# Altium schematic sheet supply.SCHDOC
size A4
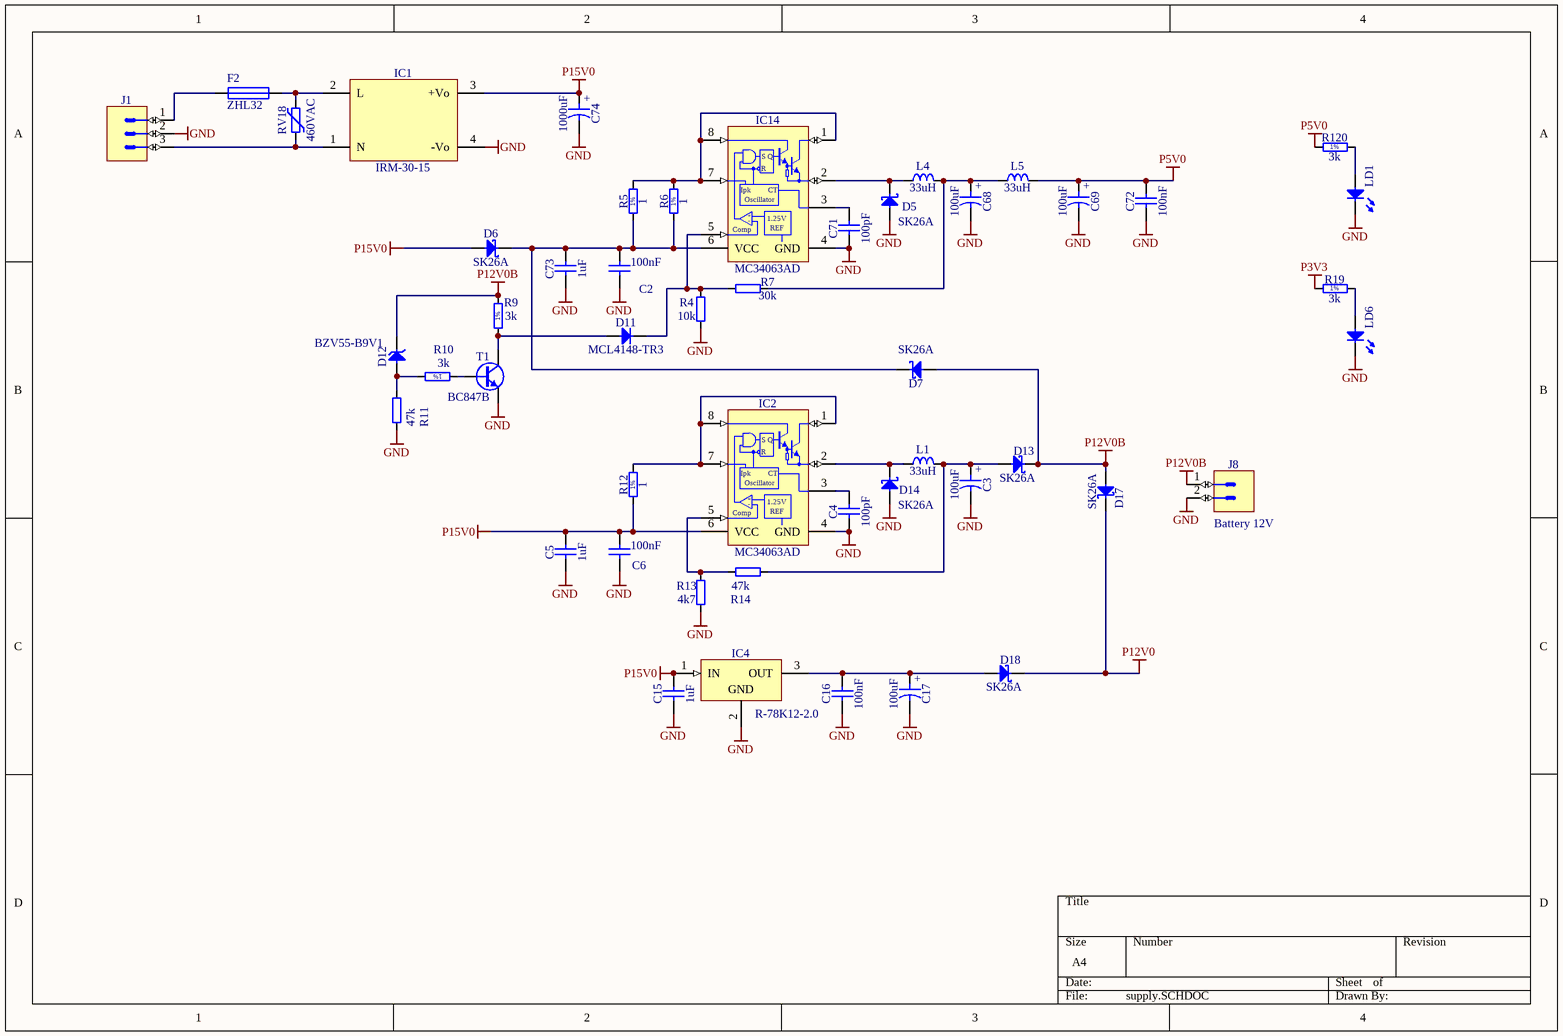
[diagram p0: supply.SCHDOC]

## Parts
C2  100nF  [CAPC1608X87N]
C3  100uF  [CAPAE660X540N]
C4  100pF  [CAPC1608X87N]
C5  1uF  [CAPC1608X87N]
C6  100nF  [CAPC1608X87N]
C15  1uF  [CAPC1608X87N]
C16  100nF  [CAPC1608X87N]
C17  100uF  [CAPAE660X540N]
C68  100uF  [CAPAE660X540N]
C69  100uF  [CAPAE660X540N]
C71  100pF  [CAPC1608X87N]
C72  100nF  [CAPC1608X87N]
C73  1uF  [CAPC1608X87N]
C74  1000uF  [CAPPR500-1050X2200]
D5  SK26A  [DIOM5126X265N]
D6  SK26A  [DIOM5126X265N]
D7  SK26A  [DIOM5126X265N]
D11  MCL4148-TR3  [DIOMELF1911N]
D12  BZV55-B9V1  [DIOMELF3515N]
D13  SK26A  [DIOM5126X265N]
D14  SK26A  [DIOM5126X265N]
D17  SK26A  [DIOM5126X265N]
D18  SK26A  [DIOM5126X265N]
F2  ZHL32  [fuse_ZHL32]
IC1  IRM-30-15  [PWS_MEANWELL_IRM-30]
IC2  MC34063AD  [SOIC127P600X175-8N]
IC4  R-78K12-2.0  [DCDC_RECOM_R-78C]
IC14  MC34063AD  [SOIC127P600X175-8N]
J1  (no value)  [PHOENIX_1757255]
J8  (no value)  [PHOENIX_1803277]
L1  33uH  [IND_BOURNS_SRP1038A]
L4  33uH  [IND_BOURNS_SRP1038A]
L5  33uH  [IND_BOURNS_SRP1038A]
LD1  Green  [LED_KINGBRIGHT_KP-1608CGCK]  (value not drawn)
LD6  Green  [LED_KINGBRIGHT_KP-1608CGCK]  (value not drawn)
R4  10k  [RESC1608X55N]
R5  1  [RESC1608X55N]
R6  1  [RESC1608X55N]
R7  30k  [RESC1608X55N]
R9  3k  [RESC1608X55N]
R10  3k  [RESC1608X55N]
R11  47k  [RESC1608X55N]
R12  1  [RESC1608X55N]
R13  4k7  [RESC1608X55N]
R14  47k  [RESC1608X55N]
R19  3k  [RESC1608X55N]
R120  3k  [RESC1608X55N]
RV18  460VAC  [VAR_EPCOS_B72210S0461K101]
T1  BC847B  [SOT95P230X110-3N]

## Nets
GND: C2.1 C3.2 C4.1 C5.1 C6.1 C15.1 C16.1 C17.2 C68.2 C69.2 C71.1 C72.1 C73.1 C74.2 D5.2(A) D14.2(A) IC1.4(-Vo) IC2.4(GND) IC4.2(GND) IC14.4(GND) J1.2 J8.2 LD1.1(C) LD6.1(C) R4.1 R11.1 R13.1 T1.2(E)
P3V3: R19.1
P5V0: C69.1 C72.2 L5.2 R120.1
P12V0: D17.1(C) D18.1(C)
P12V0B: D7.2(A) D12.1(C) D13.1(C) D17.2(A) J8.1 R9.2
P15V0: C5.2 C6.2 C15.2 C74.1 D6.2(A) IC1.3(+Vo) IC2.6(VCC) IC4.1(IN) R12.1
NetC2_2: C2.2 C73.2 D6.1(C) D7.1(C) IC14.6(VCC) R5.1 R6.1
NetC3_1: C3.1 D13.2(A) L1.2 R14.2
NetC4_2: C4.2 IC2.3(TC)
NetC16_2: C16.2 C17.1 D18.2(A) IC4.3(OUT)
NetC68_1: C68.1 L4.2 L5.1 R7.2
NetC71_2: C71.2 IC14.3(TC)
NetD5_1: D5.1(C) IC14.2(SWE) L4.1
NetD11_1: D11.1(C) IC14.5(COMP) R4.2 R7.1
NetD11_2: D11.2(A) R9.1 T1.3(C)
NetD12_2: D12.2(A) R10.2 R11.2
NetD14_1: D14.1(C) IC2.2(SWE) L1.1
NetF2_1: F2.1 J1.1
NetF2_2: F2.2 IC1.2(L) RV18.2
NetIC1_1: IC1.1(N) J1.3 RV18.1
NetIC2_1: IC2.1(SWC) IC2.7(Ipk) IC2.8(DRVC) R12.2
NetIC2_5: IC2.5(COMP) R13.2 R14.1
NetIC14_1: IC14.1(SWC) IC14.7(Ipk) IC14.8(DRVC) R5.2 R6.2
NetLD1_2: LD1.2(A) R120.2
NetLD6_2: LD6.2(A) R19.2
NetR10_1: R10.1 T1.1(B)

## Notes on the sheet
- (near J8) Battery 12V
- (in symbol CAE660-540_100UF_16V_20%) +
- (in symbol CAER_1000UF_25V_20%_VISHAY_MAL203856102E3) +
- (in symbol MC34063AD) S; Q; R; CT; Oscillator; +; -; 1.25V; Comp; REF
- (in symbol R0603_1R_1%_0.1W_200PPM) 1%
- (in symbol R0603_3K_1%_0.1W_100PPM) 1%

## Library data of the parts
C2 C6 C16 C72 = CC0603_100NF_50V_10%_X7R: Non-polarised capacitor; Part Description: SMD Multilayer Chip Ceramic Capacitor; Manufacturer: GENERIC; Manufacturer1 Part Number: 223858615649; Voltage: 50V; TC: X7R; Tolerance: ±10%; Part Number: CC0603_100NF_50V_10%_X7R; Component Kind: Standard; Component Type: Standard; Pin Count: 2; Value: 100nF; Status: Preferred; Manufacturer Part Number: CC0603_100NF_50V_10%_X7R; Case: 0603; Mounted: Yes; Socket: No; SMD: Yes; Sense: No; Manufacturer1 Example: PHYCOMP; Manufacturer1 ComponentHeight: 0.87mm; HelpURL: \\cern.ch\dfs\Applications\Altium\Datasheets\CC0603_X7R_PHYCOMP.pdf; Author: CERN DEM JLC; CreateDate: 2007-12-03; LatestRevisionDate: 2007-12-03
C3 C17 C68 C69 = CAE660-540_100UF_16V_20%: Polarised capacitor; Part Description: Aluminum Electrolytic SMT Capacitor; Manufacturer: PANASONIC; Manufacturer Part Number: EEEFK1C101AP; Voltage: 16V; Tolerance: ±20%; Part Number: CAE660-540_100UF_16V_20%; Component Kind: Standard; Component Type: Standard; Pin Count: 2; Value: 100uF; Status: Not Recommended; Case: D; Mounted: Yes; Socket: No; SMD: Yes; Sense: No; ComponentHeight: 5.8mm; HelpURL: \\cern.ch\dfs\Applications\Altium\Datasheets\CAE_PANASONIC_FK.pdf; Author: CERN DEM JLC; CreateDate: 2007-12-03; LatestRevisionDate: 2014-11-05
C4 C71 = CC0603_100PF_50V_10%_X7R: Non-polarised capacitor; Part Description: SMD Multilayer Chip Ceramic Capacitor; Manufacturer: GENERIC; Manufacturer1 Part Number: 223858615609; Voltage: 50V; TC: X7R; Tolerance: ±10%; Part Number: CC0603_100PF_50V_10%_X7R; Component Kind: Standard; Component Type: Standard; Pin Count: 2; Value: 100pF; Status: Preferred; Manufacturer Part Number: CC0603_100PF_50V_10%_X7R; Case: 0603; Mounted: Yes; Socket: No; SMD: Yes; Sense: No; Manufacturer1 Example: PHYCOMP; Manufacturer1 ComponentHeight: 0.9mm; HelpURL: \\cern.ch\dfs\Applications\Altium\Datasheets\CC0603_X7R_PHYCOMP.pdf; Author: CERN DEM JLC; CreateDate: 2012-08-15; LatestRevisionDate: 2012-08-15
C5 C15 C73 = CC0603_1UF_25V_10%_X7R: Non-polarised capacitor; Part Description: SMD Multilayer Chip Ceramic Capacitor; Manufacturer: GENERIC; Manufacturer1 Part Number: GRM188R71E105KA12D; Voltage: 25V; TC: X7R; Tolerance: ±10%; Part Number: CC0603_1UF_25V_10%_X7R; Component Kind: Standard; Component Type: Standard; Pin Count: 2; Value: 1uF; Status: None; Manufacturer Part Number: CC0603_1UF_25V_10%_X7R; Case: 0603; Mounted: Yes; Socket: No; SMD: Yes; Sense: No; Manufacturer1 Example: MURATA; Manufacturer1 ComponentHeight: 0.9mm; HelpURL: \\cern.ch\dfs\Applications\Altium\Datasheets\CC0603_X7R_MURATA.pdf; Author: CERN DEM JLC; CreateDate: 2011-01-18; LatestRevisionDate: 2011-01-18
C74 = CAER_1000UF_25V_20%_VISHAY_MAL203856102E3: Polarised capacitor; Part Description: Radial Standard Ultra Miniature Aluminum Electrolytic Capacitor (038 RSU Series); Manufacturer: VISHAY BCCOMPONENTS; Voltage: 25V; Tolerance: ±20%; Part Number: CAER_1000UF_25V_20%_VISHAY_MAL203856102E3; Component Kind: Standard; Component Type: Standard; Pin Count: 2; Value: 1000uF; Status: None; Manufacturer Part Number: MAL203856102E3; Case: LS5 D10.5 x H22; Mounted: Yes; Socket: No; SMD: No; Sense: No; ComponentHeight: 22mm; HelpURL: \\cern.ch\dfs\Applications\Altium\Datasheets\CAER_VISHAY_038 RSU.pdf; Author: CERN DEM JLC; CreateDate: 2012-08-27; LatestRevisionDate: 2012-08-27
D5-D7 D13 D14 D17 D18 = SK26A: Schottky Diode; Part Description: 2A, 60V Surface Mount Schottky Barrier Rectifier; Manufacturer: TAIWAN SEMICONDUCTOR; Voltage: 60V; Power: 2A; PressFit: No; Bonding: No; Part Number: SK26A; Component Kind: Standard; Component Type: Standard; Device: SK26A; PackageDescription: DO-214-AC/SMA Molded Diode, 2-Leads, Body 5.1x2.6mm, IPC Medium Density; Manufacturer Part Number: SK26A; Pin Count: 2; Case: DO-214AC; Mounted: Yes; Socket: No; SMD: Yes; Sense: No; ComponentHeight: 2.5mm; HelpURL: \\cern.ch\dfs\Applications\Altium\Datasheets\SK26A.pdf; Author: CERN DEM JMW; CreateDate: 2015-08-07; LatestRevisionDate: 2015-08-07
D11 = MCL4148-TR3: Diode; Part Description: Small Signal Fast Switching Diode; Manufacturer: VISHAY GENERAL SEMICONDUCTOR; Voltage: 75V; Power: 200mA; PressFit: No; Bonding: No; Part Number: MCL4148-TR3; Component Kind: Standard; Component Type: Standard; Device: MCL4148-TR3; PackageDescription: MELF Diode, 2-Leads, Body 1.7x1.15mm, IPC Medium Density; Manufacturer Part Number: MCL4148; Pin Count: 2; Mounted: Yes; Socket: No; SMD: Yes; Sense: No; ComponentHeight: 1.35mm; HelpURL: \\cern.ch\dfs\Applications\Altium\Datasheets\MCL4148-TR3.pdf; Author: CERN DEM JLC; CreateDate: 10.11.2014; LatestRevisionDate: 10.11.2014
D12 = BZV55-B9V1: Zener Diode; Part Description: Voltage Regulator Diode; Manufacturer: NEXPERIA; Voltage: 9V1; Power: 500mW; PressFit: No; Bonding: No; Part Number: BZV55-B9V1; Component Kind: Standard; Component Type: Standard; Device: BZV55-B9V1; PackageDescription: SOD80C, MELF Diode, 2-Leads, Body 3.5x1.5mm, IPC Medium Density; Manufacturer Part Number: BZV55-B9V1; Pin Count: 2; Case: SOD-80C; Mounted: Yes; Socket: No; SMD: Yes; Sense: No; ComponentHeight: 1.6mm; HelpURL: \\cern.ch\dfs\Applications\Altium\Datasheets\BZV55.pdf; Author: CERN DEM JLC; CreateDate: 06.05.2008; LatestRevisionDate: 22.01.2018
F2 = FUSE
IC1 = AC_DC_IRM-30-15: Power Supply; Part Description: 85-264VAC to 15VDC (2000mA) 30W Power Supply; Manufacturer: MEAN WELL; PressFit: No; Bonding: No; Part Number: IRM-30-15; Component Kind: Standard; Component Type: Standard; Device: IRM-30-15; PackageDescription: IRM-10 Series, Body 45.7x25.4mm, Power Supply; Status: None; Manufacturer Part Number: IRM-30-15; Pin Count: 4; Mounted: Yes; Socket: No; SMD: No; Sense: No; ComponentHeight: 21.5mm; HelpURL: \\cern.ch\dfs\Applications\Altium\Datasheets\IRM-10-12.pdf; Author: GK; CreateDate: 14.02.2018; LatestRevisionDate: 14.02.2018
IC2 IC14 = MC34063AD: 3V to 40V 1.5A Peak Boost/Buck/Inverting Switching Regulator; Manufacturer: TEXAS INSTRUMENTS; PressFit: No; Bonding: No; Part Number: MC34063AD; Component Kind: Standard; Component Type: Standard; Device: MC34063AD; PackageDescription: SOIC 8, Pitch 1.27mm - Body 4x5mm, IPC Medium Density; Part Description: 3V to 40V 1.5A Peak Boost/Buck/Inverting Switching Regulator; Manufacturer Part Number: MC34063AD; Pin Count: 8; Case: SOIC8; Mounted: Yes; Socket: No; SMD: Yes; Sense: No; ComponentHeight: 1.75mm; HelpURL: \\cern.ch\dfs\Applications\Altium\Datasheets\MC34063AD.pdf; Author: CERN DEM JLC; CreateDate: 2009-10-27; LatestRevisionDate: 2009-10-27
IC4 = R-78C12-1.0: 15-42VDC to 12VDC, Iout (max) 1A, DC-DC Converter; Part Description: DC/DC; Uin: 14÷36V; Uout: 12VDC; Iout: 2A; SIP3; THT; Manufacturer: RECOM; PressFit: No; Bonding: No; Part Number: R-78K12-2.0; Component Kind: Standard; Component Type: Standard; Device: R-78K12-2.0; PackageDescription: R-78C Series, Body 11.6x8.50mm, SIP-3 Package; Manufacturer Part Number: R-78K12-2.0; Pin Count: 3; Mounted: Yes; Socket: No; SMD: No; Sense: No; ComponentHeight: 10.9mm; HelpURL: \\cern.ch\dfs\Applications\Altium\Datasheets\RECOM_R-78C.pdf; Author: CERN DEM BC; CreateDate: 19.08.2020; LatestRevisionDate: 19.08.2020
J1 = PHOENIX_1757255: Connector 3 Male; Part Description: 12A, 250V, Pitch 5.08mm, 3 Positions Header; Manufacturer: PHOENIX CONTACT; Manufacturer Part Number: 1757255 (MSTBA 2,5/ 3-G-5,08); PressFit: No; Part Number: PHOENIX_1757255; Component Kind: Standard; Component Type: Standard; Pin Count: 3; Mounted: Yes; Socket: No; SMD: No; Sense: No; Status: None; ComponentHeight: 8.6mm; HelpURL: \\cern.ch\dfs\Applications\Altium\Datasheets\PHOENIX_1757255.pdf; Author: CERN DEM JLC; CreateDate: 10.02.2010; LatestRevisionDate: 26.04.2010
J8 = PHOENIX_1803277: Connector 2 Male; Part Description: 8A 160 V, Pitch: 3.81mm, 2 Positions  Right Angled Header; Manufacturer: PHOENIX CONTACT; Manufacturer Part Number: 1803277 (MC 1,5/ 2-G-3,81); PressFit: No; Part Number: PHOENIX_1803277; Component Kind: Standard; Component Type: Standard; Pin Count: 2; Mounted: Yes; Socket: No; SMD: No; Sense: No; Status: None; ComponentHeight: 7.25mm; HelpURL: \\cern.ch\dfs\Applications\Altium\Datasheets\PHOENIX_1803277.pdf; Author: CERN DEM JLC; CreateDate: 06.05.2014; LatestRevisionDate: 06.05.2014
L1 L4 L5 = IND_33UH_20%_BOURNS_SRP1038A: Inductor; Part Description: Shielded SMD Power Inductor; Manufacturer: BOURNS; Manufacturer Part Number: SRP1038A-330M; Power: 3.5A; Resistance: 0.092R; Tolerance: ±20%; Part Number: IND_33UH_20%_BOURNS_SRP1038A; Component Kind: Standard; Component Type: Standard; Pin Count: 2; Value: 33uH; Mounted: Yes; Socket: No; SMD: Yes; Sense: No; ComponentHeight: 4mm; HelpURL: \\cern.ch\dfs\Applications\Altium\Datasheets\IND_BOURNS_SRP1038A.pdf; Author: CERN DEM HF; CreateDate: 26.01.2024; LatestRevisionDate: 26.01.2024
LD1 LD6 = LED_KINGBRIGHT_KP-1608CGCK: LED Green 1C 2A; Part Description: 1.6x0.8mm SMD Chip Green LED Lamp; PressFit: No; Bonding: No; Part Number: LED_KINGBRIGHT_KP-1608CGCK; Component Kind: Standard; Component Type: Standard; Color: Green; PackageDescription: SMT Green LED, Case 0603, Body L 1.60mm x W 0.80mm x H 1.10mm; Manufacturer: KINGBRIGHT; Manufacturer Part Number: KP-1608CGCK; Pin Count: 2; Case: 0603; Mounted: Yes; Socket: No; SMD: Yes; Sense: No; ComponentHeight: 1.1mm; HelpURL: \\cern.ch\dfs\Applications\Altium\Datasheets\LED_KINGBRIGHT_KP-1608CGCK.pdf; Author: CERN DEM HF; CreateDate: 01.10.2021; LatestRevisionDate: 01.10.2021
R4 = R0603_10K_1%_0.1W_100PPM: Resistor - 1%; Part Description: General Purpose Thick Film Chip Resistor; Manufacturer: GENERIC; Manufacturer1 Part Number: NRC06F1002TRF; Power: 0.1W; TC: ±100ppm/°C; PressFit: No; Part Number: R0603_10K_1%_0.1W_100PPM; Component Kind: Standard; Component Type: Standard; Pin Count: 2; Value: 10k; Status: Preferred; Tolerance: ±1%; Manufacturer Part Number: R0603_10K_1%_0.1W_100PPM; Case: 0603; Mounted: Yes; Sense: No; Socket: No; SMD: Yes; Manufacturer1 Example: NIC COMPONENT; Manufacturer1 ComponentHeight: 0.55mm; HelpURL: \\cern.ch\dfs\Applications\Altium\Datasheets\R0603_NIC_NRC.pdf; Author: CERN DEM JLC; CreateDate: 03.12.2007; LatestRevisionDate: 13.03.2008
R5 R6 R12 = R0603_1R_1%_0.1W_200PPM: Resistor - 1%; Part Description: General Purpose Thick Film Chip Resistor; Manufacturer: GENERIC; Manufacturer1 Part Number: 232270461008L or RC0603FR-071RL; Power: 0.1W; TC: ±200ppm/°C; Part Number: R0603_1R_1%_0.1W_200PPM; Component Kind: Standard; Component Type: Standard; Pin Count: 2; Value: 1; Status: Preferred; Tolerance: ±1%; Manufacturer Part Number: R0603_1R_1%_0.1W_200PPM; Case: 0603; Mounted: Yes; Sense: No; Socket: No; SMD: Yes; Manufacturer1 Example: YAGEO PHYCOMP; Manufacturer1 ComponentHeight: 0.65mm; HelpURL: \\cern.ch\dfs\Applications\Altium\Datasheets\R0603_Phycomp_RC0603.pdf; Author: CERN DEM JLC; CreateDate: 2007-12-03; LatestRevisionDate: 2012-10-17
R7 = R0603_30K_1%_0.1W_100PPM: Resistor - 1%; Part Description: General Purpose Thick Film Chip Resistor; Manufacturer: GENERIC; Manufacturer1 Part Number: NRC06F3002TRF; Power: 0.1W; TC: ±100ppm/°C; PressFit: No; Part Number: R0603_30K_1%_0.1W_100PPM; Component Kind: Standard; Component Type: Standard; Pin Count: 2; Value: 30k; Status: Preferred; Tolerance: ±1%; Manufacturer Part Number: R0603_30K_1%_0.1W_100PPM; Case: 0603; Mounted: Yes; Sense: No; Socket: No; SMD: Yes; Manufacturer1 Example: NIC COMPONENT; Manufacturer1 ComponentHeight: 0.55mm; HelpURL: \\cern.ch\dfs\Applications\Altium\Datasheets\R0603_NIC_NRC.pdf; Author: CERN DEM JLC; CreateDate: 03.12.2007; LatestRevisionDate: 13.03.2008
R9 R10 R19 R120 = R0603_3K_1%_0.1W_100PPM: Resistor - 1%; Part Description: General Purpose Thick Film Chip Resistor; Manufacturer: GENERIC; Manufacturer1 Part Number: NRC06F3001TRF; Power: 0.1W; TC: ±100ppm/°C; Part Number: R0603_3K_1%_0.1W_100PPM; Component Kind: Standard; Component Type: Standard; Pin Count: 2; Value: 3k; Status: Preferred; Tolerance: ±1%; Manufacturer Part Number: R0603_3K_1%_0.1W_100PPM; Case: 0603; Mounted: Yes; Sense: No; Socket: No; SMD: Yes; Manufacturer1 Example: NIC COMPONENT; Manufacturer1 ComponentHeight: 0.55mm; HelpURL: \\cern.ch\dfs\Applications\Altium\Datasheets\R0603_NIC_NRC.pdf; Author: CERN DEM JLC; CreateDate: 2007-12-03; LatestRevisionDate: 2008-03-13
R11 R14 = R0603_47K_1%_0.1W_100PPM: Resistor - 1%; Part Description: General Purpose Thick Film Chip Resistor; Manufacturer: GENERIC; Manufacturer1 Part Number: NRC06F4702TRF; Power: 0.1W; TC: ±100ppm/°C; PressFit: No; Part Number: R0603_47K_1%_0.1W_100PPM; Component Kind: Standard; Component Type: Standard; Pin Count: 2; Value: 47k; Status: Preferred; Tolerance: ±1%; Manufacturer Part Number: R0603_47K_1%_0.1W_100PPM; Case: 0603; Mounted: Yes; Sense: No; Socket: No; SMD: Yes; Manufacturer1 Example: NIC COMPONENT; Manufacturer1 ComponentHeight: 0.55mm; HelpURL: \\cern.ch\dfs\Applications\Altium\Datasheets\R0603_NIC_NRC.pdf; Author: CERN DEM JLC; CreateDate: 03.12.2007; LatestRevisionDate: 13.03.2008
R13 = R0603_4K7_1%_0.1W_100PPM: Resistor - 1%; Part Description: General Purpose Thick Film Chip Resistor; Manufacturer: GENERIC; Manufacturer1 Part Number: NRC06F4701TRF; Power: 0.1W; TC: ±100ppm/°C; PressFit: No; Part Number: R0603_4K7_1%_0.1W_100PPM; Component Kind: Standard; Component Type: Standard; Pin Count: 2; Value: 4k7; Status: Preferred; Tolerance: ±1%; Manufacturer Part Number: R0603_4K7_1%_0.1W_100PPM; Case: 0603; Mounted: Yes; Sense: No; Socket: No; SMD: Yes; Manufacturer1 Example: NIC COMPONENT; Manufacturer1 ComponentHeight: 0.55mm; HelpURL: \\cern.ch\dfs\Applications\Altium\Datasheets\R0603_NIC_NRC.pdf; Author: CERN DEM JLC; CreateDate: 03.12.2007; LatestRevisionDate: 13.03.2008
RV18 = VAR_EPCOS_B72210S0461K101: Varistor; Part Description: SIOV Metal Oxide Varistor; Manufacturer: EPCOS; Manufacturer Part Number: B72210S0461K101 or  S10K460; Power: 0.4W; Tolerance: ±10%; Part Number: VAR_EPCOS_B72210S0461K101; Component Kind: Standard; Component Type: Standard; Pin Count: 2; Status: None; Voltage: 460VAC; Mounted: Yes; Socket: No; SMD: No; Sense: No; ComponentHeight: 15mm; HelpURL: \\cern.ch\dfs\Applications\Altium\Datasheets\VAR_EPCOS_B72210S0461K101.pdf; Author: CERN DEM JLC; CreateDate: 2008-10-14; LatestRevisionDate: 2011-09-15
T1 = BC847B: NPN Transistor; Part Description: 45V 100mA NPN General-Purpose Transistor; Manufacturer: NXP SEMICONDUCTORS; PressFit: No; Bonding: No; Part Number: BC847B; Component Kind: Standard; Component Type: Standard; Device: BC847B; PackageDescription: SOT23, 0.95mm Pitch; 3 Pin, 1.30mm W X 2.90mm L X 1.10mm H body, IPC Medium Density; Manufacturer Part Number: BC847B; Pin Count: 3; Case: SOT23-3; Mounted: Yes; Socket: No; SMD: Yes; Sense: No; ComponentHeight: 1.1mm; HelpURL: \\cern.ch\dfs\Applications\Altium\Datasheets\BC847B.pdf; Author: CERN DEM JLC; CreateDate: 14.06.2011; LatestRevisionDate: 14.06.2011